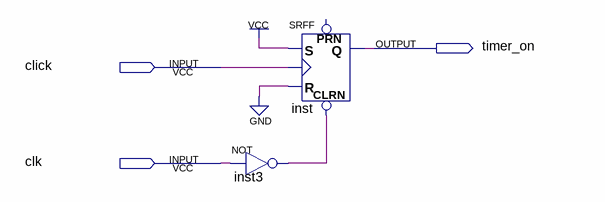
[diagram p0: schematic sheet]
// Quartus schematic rsff.bdf as structural Verilog: 2 symbols, 3 pins
module rsff (
  input  click,
  input  clk,
  output timer_on
);

  wire inst3_out;

  not inst3 (inst3_out, clk);
  SRFF inst (.CLRN(inst3_out), .S(1'b1), .R(1'b0), .CLK(click), .Q(timer_on));  // open: PRN
endmodule
